# EAGLE schematic TE Module driver (EAGLE 9.6.2)
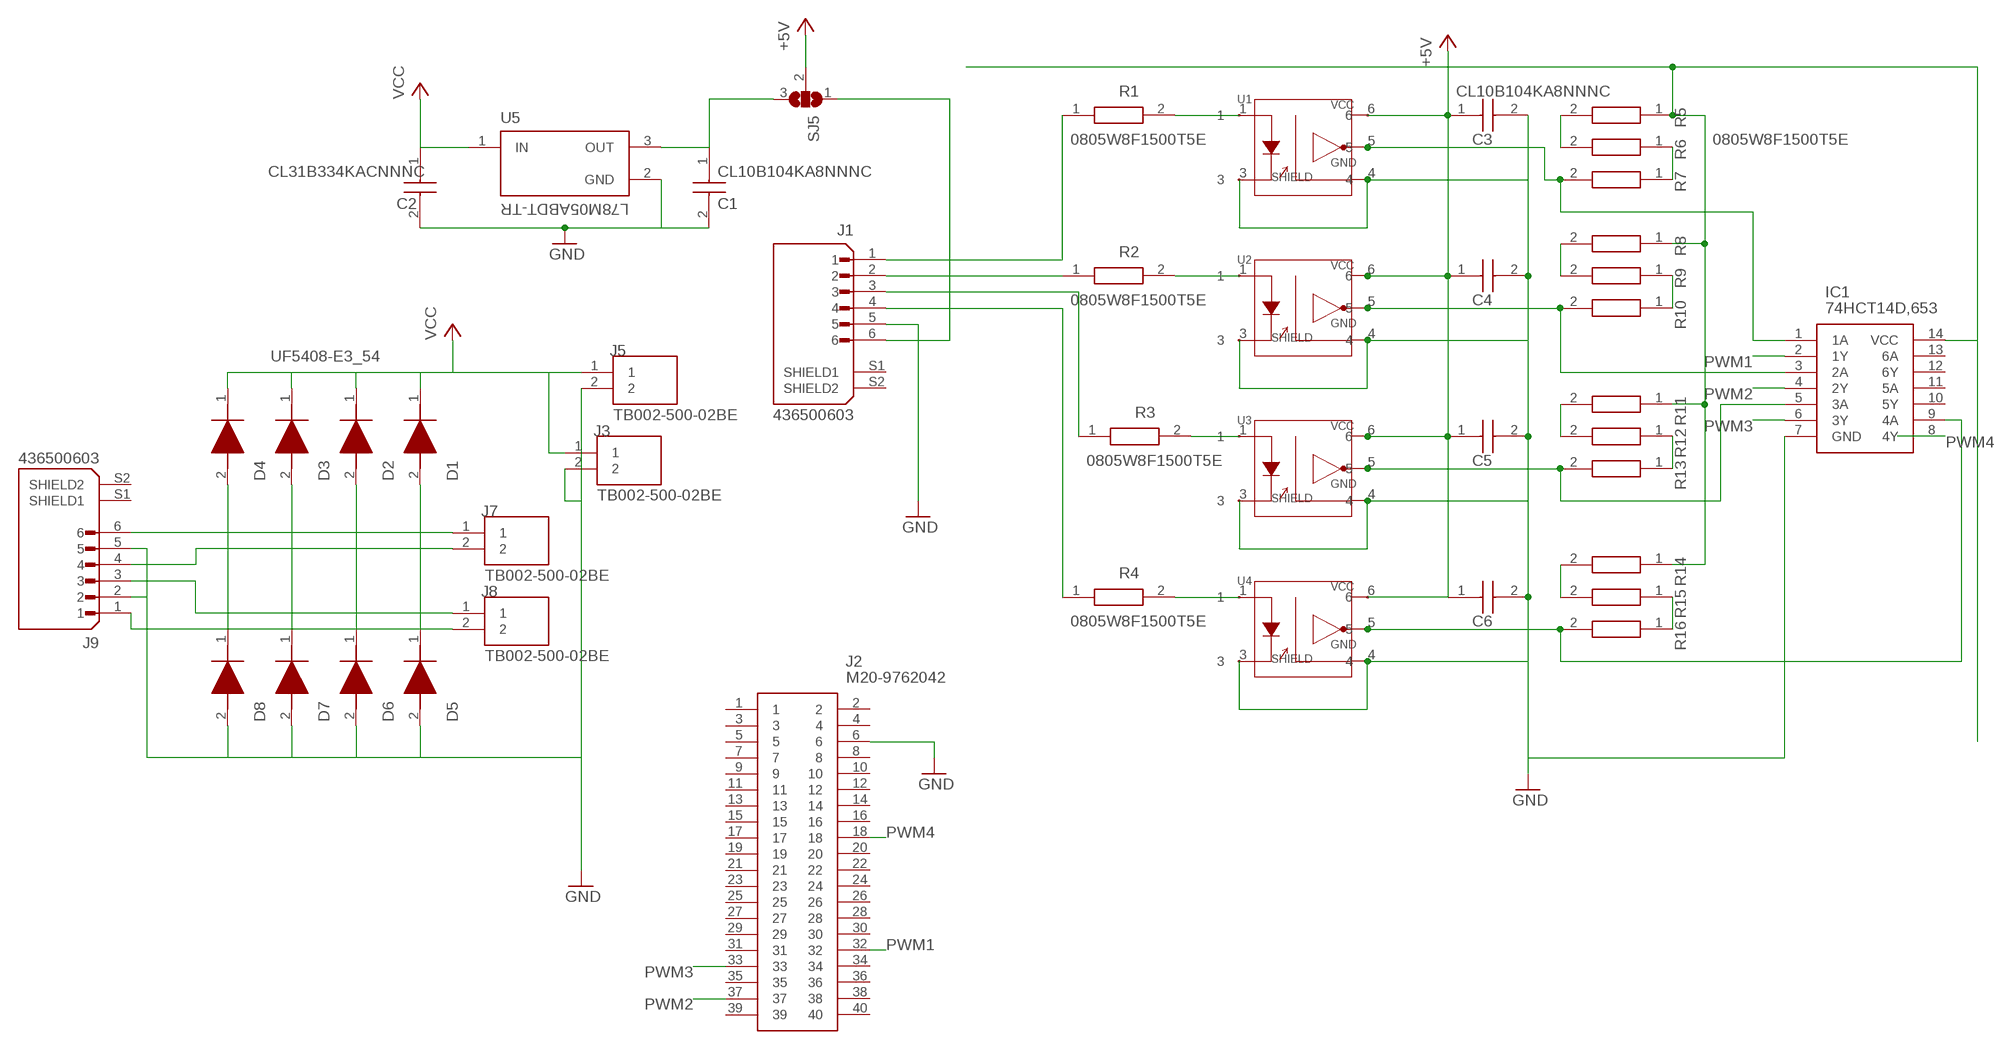
[diagram p0: schematic, sheet 1]

## Parts
C1  CL10B104KA8NNNC  [CAPC1608X90N]
C2  CL31B334KACNNNC  [CAPC3216X140N]
C3  CL10B104KA8NNNC  [CAPC1608X90N]
C4  CL10B104KA8NNNC  [CAPC1608X90N]
C5  CL10B104KA8NNNC  [CAPC1608X90N]
C6  CL10B104KA8NNNC  [CAPC1608X90N]
D1  UF5408-E3_54  [DIOAD2855W132L835D505]
D2  UF5408-E3_54  [DIOAD2855W132L835D505]
D3  UF5408-E3_54  [DIOAD2855W132L835D505]
D4  UF5408-E3_54  [DIOAD2855W132L835D505]
D5  UF5408-E3_54  [DIOAD2855W132L835D505]
D6  UF5408-E3_54  [DIOAD2855W132L835D505]
D7  UF5408-E3_54  [DIOAD2855W132L835D505]
D8  UF5408-E3_54  [DIOAD2855W132L835D505]
IC1  74HCT14D,653  [SOIC127P600X175-14N]
J1  436500603  [MOLEX_436500603]
J2  M20-9762042  [HDRV40W64P254_2X20_5080X508X83]
J3  TB002-500-02BE  [CUI_TB002-500-02BE]
J5  TB002-500-02BE  [CUI_TB002-500-02BE]
J7  TB002-500-02BE  [CUI_TB002-500-02BE]
J8  TB002-500-02BE  [CUI_TB002-500-02BE]
J9  436500603  [MOLEX_436500603]
R1  0805W8F1500T5E  [RESC2013X65N]
R2  0805W8F1500T5E  [RESC2013X65N]
R3  0805W8F1500T5E  [RESC2013X65N]
R4  0805W8F1500T5E  [RESC2013X65N]
R5  0805W8F1500T5E  [RESC2013X65N]
R6  0805W8F1500T5E  [RESC2013X65N]
R7  0805W8F1500T5E  [RESC2013X65N]
R8  0805W8F1500T5E  [RESC2013X65N]
R9  0805W8F1500T5E  [RESC2013X65N]
R10  0805W8F1500T5E  [RESC2013X65N]
R11  0805W8F1500T5E  [RESC2013X65N]
R12  0805W8F1500T5E  [RESC2013X65N]
R13  0805W8F1500T5E  [RESC2013X65N]
R14  0805W8F1500T5E  [RESC2013X65N]
R15  0805W8F1500T5E  [RESC2013X65N]
R16  0805W8F1500T5E  [RESC2013X65N]
SJ5  SJ2W  [SJ_2]
U1  TLP2362(TPL,E(T  [5PIN_SO6_TOS]
U2  TLP2362(TPL,E(T  [5PIN_SO6_TOS]
U3  TLP2362(TPL,E(T  [5PIN_SO6_TOS]
U4  TLP2362(TPL,E(T  [5PIN_SO6_TOS]
U5  L78M05ABDT-TR  [VREG_L78M05ABDT-TR]

## Nets
+5V: C3.1 C4.1 C5.1 C6.1 IC1.14(VCC) R5.1 R8.1 R11.1 R14.1 SJ5.2 U1.6 U2.6 U3.6 U4.6
GND: C1.2 C2.2 C3.2 C4.2 C5.2 C6.2 D5.2(A) D6.2(A) D7.2(A) D8.2(A) IC1.7(GND) J1.5 J2.6 J3.2 J5.2 J9.2 J9.5 U1.3 U1.4 U2.3 U2.4 U3.3 U3.4 U4.3 U4.4 U5.2(GND)
N$1: J1.2 R2.1
N$2: D4.2(A) D8.1(K) J7.1 J9.6
N$3: D3.2(A) D7.1(K) J7.2 J9.4
N$4: D2.2(A) D6.1(K) J8.1 J9.3
N$5: D1.2(A) D5.1(K) J8.2 J9.1
N$6: R2.2 U2.1
N$7: R1.2 U1.1
N$8: IC1.3(2A) R10.2 U2.5
N$9: IC1.5(3A) R13.2 U3.5
N$10: R3.2 U3.1
N$11: R4.2 U4.1
N$12: C1.1 SJ5.3 U5.3(OUT)
N$14: IC1.1(1A) R7.2 U1.5
N$15: R5.2 R6.2
N$16: R6.1 R7.1
N$18: J1.6 SJ5.1
N$19: J1.1 R1.1
N$20: J1.3 R3.1
N$21: J1.4 R4.1
N$26: R8.2 R9.2
N$27: R9.1 R10.1
N$30: R11.2 R12.2
N$31: R12.1 R13.1
N$33: IC1.9(4A) R16.2 U4.5
N$34: R14.2 R15.2
N$35: R15.1 R16.1
PWM1: IC1.2(1Y) J2.32
PWM2: IC1.4(2Y) J2.37
PWM3: IC1.6(3Y) J2.33
PWM4: IC1.8(4Y) J2.18
VCC: C2.1 D1.1(K) D2.1(K) D3.1(K) D4.1(K) J3.1 J5.1 U5.1(IN)
Unconnected: IC1.10(5Y) IC1.11(5A) IC1.12(6Y) IC1.13(6A) J1.S1(SHIELD1) J1.S2(SHIELD2) J2.1 J2.2 J2.3 J2.4 J2.5 J2.7 J2.8 J2.9 J2.10 J2.11 J2.12 J2.13 J2.14 J2.15 J2.16 J2.17 J2.19 J2.20 J2.21 J2.22 J2.23 J2.24 J2.25 J2.26 J2.27 J2.28 J2.29 J2.30 J2.31 J2.34 J2.35 J2.36 J2.38 J2.39 J2.40 J9.S1(SHIELD1) J9.S2(SHIELD2)

## Library data of the parts
C1 C3-C6 = SamacSys_Parts:CL10B104KA8NNNC: Ceramic cap 0603 X7R 25V 100nF (Reel) Samsung Electro-Mechanics 100nF Multilayer Ceramic Capacitor (MLCC) 25 V +/-10% X7R dielectric CL max op. temp. +125C Source: Datasheet <http://media.digikey.com/pdf/Data Sheets/Samsung PDFs/CL_Series_MLCC_ds.pdf>; ARROW_PART_NUMBER: CL10B104KA8NNNC; ARROW_PRICE-STOCK: https://www.arrow.com/en/products/cl10b104ka8nnnc/samsung-electro-mechanics?region=europe; DESCRIPTION: Ceramic cap 0603 X7R 25V 100nF (Reel) Samsung Electro-Mechanics 100nF Multilayer Ceramic Capacitor (MLCC) 25 V +/-10% X7R dielectric CL max op. temp. +125C; HEIGHT: 0.9mm; LCSC_PART: C1590; MANUFACTURER_NAME: Samsung Electro-Mechanics; MANUFACTURER_PART_NUMBER: CL10B104KA8NNNC; MOUSER_PART_NUMBER: 187-CL10B104KA8NNNC; MOUSER_PRICE-STOCK: https://www.mouser.co.uk/ProductDetail/Samsung-Electro-Mechanics/CL10B104KA8NNNC?qs=349EhDEZ59rmu3pGeZXx0A%3D%3D
C2 = SamacSys_Parts:CL31B334KACNNNC: Multilayer Ceramic Capacitors MLCC - SMD/SMT 330nF+/-10% 25V X7R 1206 Source: Datasheet <https://datasheet.lcsc.com/lcsc/1912111437_Samsung-Electro-Mechanics-CL31B334KACNNNC_C318760.pdf>; DESCRIPTION: Multilayer Ceramic Capacitors MLCC - SMD/SMT 330nF+/-10% 25V X7R 1206; HEIGHT: 1.4mm; LCSC_PART: C318760; MANUFACTURER_NAME: Samsung Electro-Mechanics; MANUFACTURER_PART_NUMBER: CL31B334KACNNNC
D1-D8 = SamacSys_Parts:UF5408-E3_54: Rectifiers Vr/1000V Io/3A Source: Datasheet <https://componentsearchengine.com/Datasheets/1/UF5408-E3_54.pdf>; ARROW_PART_NUMBER: UF5408-E3/54; ARROW_PRICE-STOCK: https://www.arrow.com/en/products/uf5408-e354/vishay?region=nac; DESCRIPTION: Rectifiers Vr/1000V Io/3A; HEIGHT: mm; MANUFACTURER_NAME: Vishay; MANUFACTURER_PART_NUMBER: UF5408-E3/54; MOUSER_PART_NUMBER: 625-UF5408-E3; MOUSER_PRICE-STOCK: https://www.mouser.co.uk/ProductDetail/Vishay-General-Semiconductor/UF5408-E3-54?qs=D6r9GjgEnNMkLmquNRV%2FYA%3D%3D
IC1 = SamacSys_Parts:74HCT14D,653: 74HC(T)14 - Hex inverting Schmitt trigger@en-us Source: Datasheet <https://assets.nexperia.com/documents/data-sheet/74HC_HCT14.pdf>; ARROW_PART_NUMBER: 74HCT14D,653; ARROW_PRICE-STOCK: https://www.arrow.com/en/products/74hct14d653/nexperia?region=europe; DESCRIPTION: 74HC(T)14 - Hex inverting Schmitt trigger@en-us; HEIGHT: 1.75mm; LCSC_PART: C5967; MANUFACTURER_NAME: Nexperia; MANUFACTURER_PART_NUMBER: 74HCT14D,653; MOUSER_PART_NUMBER: 771-74HCT14D-T; MOUSER_PRICE-STOCK: https://www.mouser.co.uk/ProductDetail/Nexperia/74HCT14D653?qs=P62ublwmbi%2FQcvMOcCK30w%3D%3D; PACKAGE: SOIC-14_3.9x8.7x1.27P
J1 J9 = SnapEDA Library:436500603; MANUFACTURER: Molex; MAXIMUM_PACKAGE_HEIGHT: 5.57 mm; PARTREV: F3; STANDARD: Manufacturer Recommendations
J2 = SamacSys_Parts:M20-9762042: Headers & Wire Housings 20+20 DIL VERTICAL PIN HEADER GOLD+TIN Source: Datasheet <https://cdn.harwin.com/pdfs/M20-976.pdf>; DESCRIPTION: Headers & Wire Housings 20+20 DIL VERTICAL PIN HEADER GOLD+TIN; HEIGHT: 8.38mm; MANUFACTURER_NAME: Harwin; MANUFACTURER_PART_NUMBER: M20-9762042; MOUSER_PART_NUMBER: 855-M20-9762042; MOUSER_PRICE-STOCK: https://www.mouser.co.uk/ProductDetail/Harwin/M20-9762042?qs=vF78I%252BjhbY9cC9ob9MEFaw%3D%3D
J3 J5 J7 J8 = SnapEDA Library:TB002-500-02BE; MANUFACTURER: CUI; STANDARD: Manufacturer Recommendations
R1-R16 = SamacSys_Parts:0805W8F1500T5E: Thick Film Resistors - SMD 0805 1/8W 1% 150R T/R-5000 Source: Datasheet <https://datasheet.lcsc.com/lcsc/2206010216_UNI-ROYAL-Uniroyal-Elec-0805W8F1500T5E_C17471.pdf>; DESCRIPTION: Thick Film Resistors - SMD 0805 1/8W 1% 150R T/R-5000; HEIGHT: 0.65mm; LCSC_PART: C17471; MANUFACTURER_NAME: ROYALOHM; MANUFACTURER_PART_NUMBER: 0805W8F1500T5E
SJ5 = jumper:SJ2W: SMD solder JUMPER
U1-U4 = SnapEDA Library:TLP2362(TPL,E(T; COPYRIGHT: Copyright (C) 2022 Ultra Librarian. All rights reserved.; LCSC_PART: C37658; MANUFACTURER_PART_NUMBER: TLP2362(TPL,E(T; MFR_NAME: Toshiba Electronic Devices & Storage Co.; PACKAGE: SOP-5_3.6x4.4x1.27P
U5 = SnapEDA Library:L78M05ABDT-TR: Linear Voltage Regulator IC 1 Output 500mA DPAK; LCSC_PART: C58069; MANUFACTURER: STMicroelectronics; MAXIMUM_PACKAGE_HEIGHT: 2.4 mm; PACKAGE: TO-252-2; PARTREV: 23; STANDARD: Manufacturer Recommendations